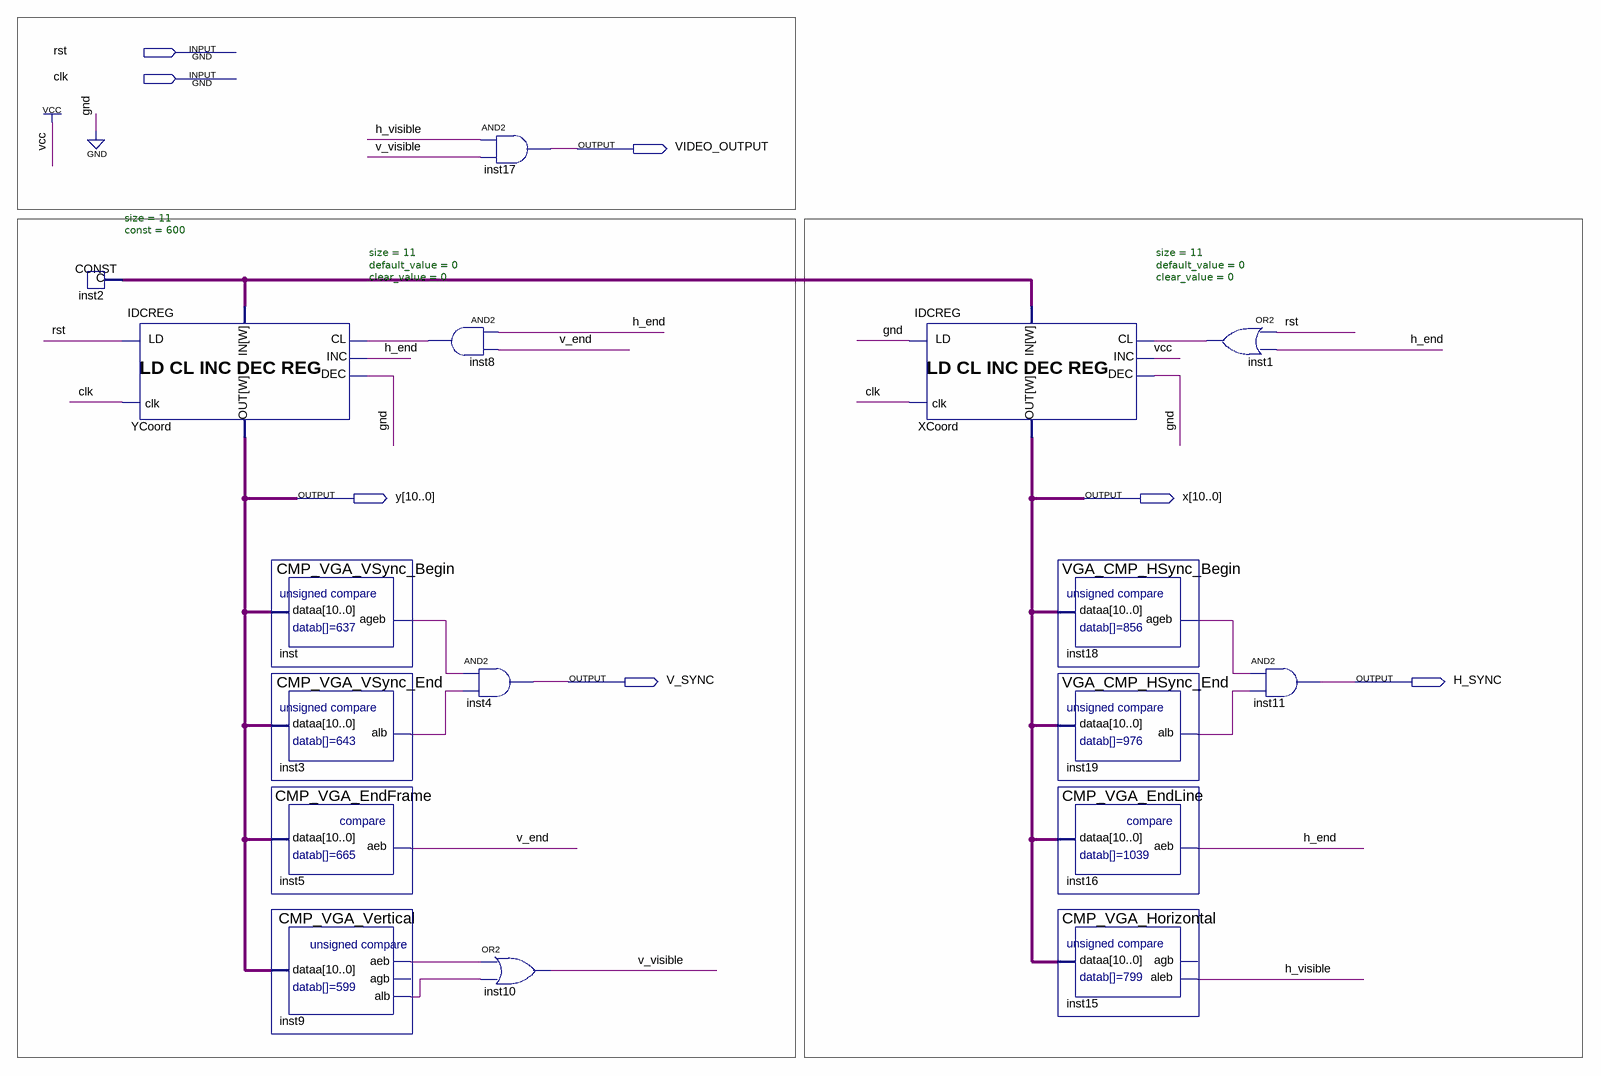
[diagram p0: schematic sheet]
// Quartus schematic MasterSyncGenerator.bdf as structural Verilog: 17 symbols, 7 pins
module MasterSyncGenerator (
  input  rst,
  input  clk,
  output VIDEO_OUTPUT,
  output [10:0] y,
  output [10:0] x,
  output V_SYNC,
  output H_SYNC
);

  wire h_end, h_visible, inst1_out, inst3_alb, inst8_out, inst9_aeb, inst9_alb, inst18_ageb, inst19_alb,
       inst_ageb, v_end, v_visible;
  wire [10:0] inst2_data;

  CONST #(.size(11), .\const (600)) inst2 (.data(inst2_data));
  IDCREG #(.size(11), .default_value(0), .clear_value(0)) YCoord (
    .clk(clk), .data_in(inst2_data), .cl(inst8_out), .inc(h_end), .dec(1'b0), .ld(rst), .data_out(y));
  CMP_VGA_VSync_Begin inst (.dataa(y), .ageb(inst_ageb));
  CMP_VGA_VSync_End inst3 (.dataa(y), .alb(inst3_alb));
  CMP_VGA_EndFrame inst5 (.dataa(y), .aeb(v_end));
  CMP_VGA_Vertical inst9 (.dataa(y), .aeb(inst9_aeb), .alb(inst9_alb));  // open: agb
  and inst8 (inst8_out, h_end, v_end);
  and inst4 (V_SYNC, inst_ageb, inst3_alb);
  and inst17 (VIDEO_OUTPUT, h_visible, v_visible);
  or inst10 (v_visible, inst9_aeb, inst9_alb);
  IDCREG #(.size(11), .default_value(0), .clear_value(0)) XCoord (
    .clk(clk), .data_in(inst2_data), .cl(inst1_out), .inc(1'b1), .dec(1'b0), .ld(1'b0), .data_out(x));
  VGA_CMP_HSync_Begin inst18 (.dataa(x), .ageb(inst18_ageb));
  VGA_CMP_HSync_End inst19 (.dataa(x), .alb(inst19_alb));
  CMP_VGA_EndLine inst16 (.dataa(x), .aeb(h_end));
  CMP_VGA_Horizontal inst15 (.dataa(x), .aleb(h_visible));  // open: agb
  or inst1 (inst1_out, rst, h_end);
  and inst11 (H_SYNC, inst18_ageb, inst19_alb);
endmodule
